# EAGLE design daisy-remote (EAGLE 7.6.0)
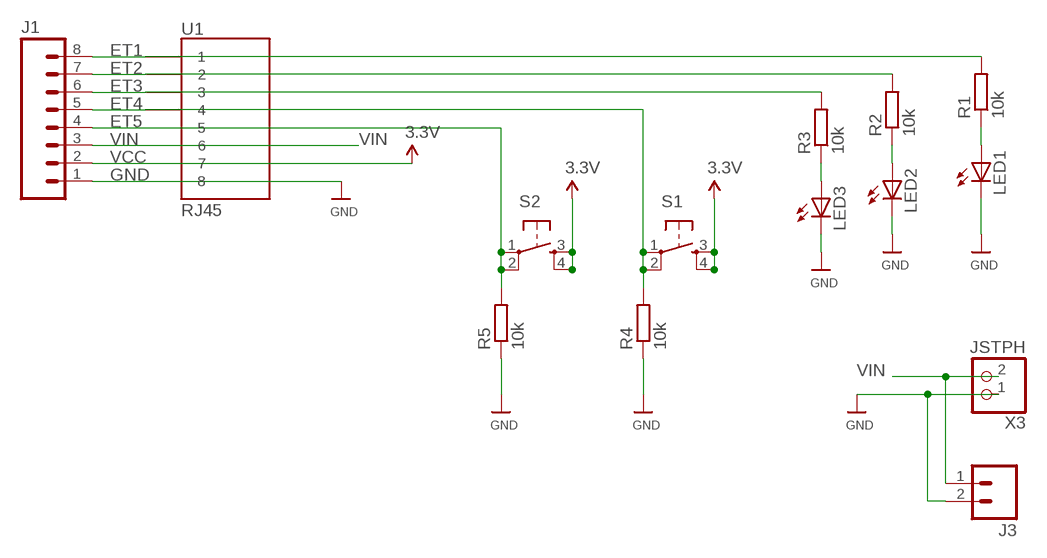
[diagram p0: schematic, sheet 1]

## Parts
J1  M08  [1X08_ROUND]
J3  M02PTH  [1X02]
LED1  LED5MM  [LED5MM]
LED2  LED5MM  [LED5MM]
LED3  LED5MM  [LED5MM]
R1  10k  R-EU_0204/7  [0204/7]
R2  10k  R-EU_0204/7  [0204/7]
R3  10k  R-EU_0204/7  [0204/7]
R4  10k  R-EU_0204/7  [0204/7]
R5  10k  R-EU_0204/7  [0204/7]
S1  TAC_SWITCHPTH  [TACTILE-PTH]
S2  TAC_SWITCHPTH  [TACTILE-PTH]
U1  RJ45  RJ45-8PTH  [RJ45-8]
X3  JSTPH  CON_JST_PH_2PIN  [JSTPH2]

## Nets
ET1: J1.8 R1.2 U1.1
ET2: J1.7 R2.2 U1.2
ET3: J1.6 R3.2 U1.3
ET4: J1.5 R4.2 S1.1 S1.2 U1.4
ET5: J1.4 R5.2 S2.1 S2.2 U1.5
GND [power]: J1.1 J3.2 LED1.K(C) LED2.K(C) LED3.K(C) R4.1 R5.1 U1.8 X3.1
N$2: LED1.A R1.1
N$3: LED2.A R2.1
N$5: LED3.A R3.1
VCC: J1.2 S1.3 S1.4 S2.3 S2.4 U1.7 ; supply symbol labelled 3.3V
VIN [power]: J1.3 J3.1 U1.6 X3.2

## Library data of the parts
J1 = SparkFun-Connectors:M08: Header 8 Standard 8-pin 0.1" header. Use with straight break away headers (SKU : PRT-00116), right angle break away headers (PRT-00553), swiss pins (PRT-00743), machine pins (PRT-00117), and female headers (PRT-00115).; PROD_ID: CONN-08437
J3 = SparkFun-Connectors:M02: Standard 2-pin 0.1" header. Use with - straight break away headers ( PRT-00116) - right angle break away headers (PRT-00553) - swiss pins (PRT-00743) - machine pins (PRT-00117) - female headers (PRT-00115) Molex polarized connector foot print use with: PRT-08233 with associated crimp pins and housings. 2.54_SCREWTERM for use with PRT-10571. 3.5mm Screw Terminal footprints for PRT-08084 5mm Screw Terminal footprints for use with PRT-08432
LED1-LED3 = led:LED: LED OSRAM: - CHIPLED LG R971, LG N971, LY N971, LG Q971, LY Q971, LO R971, LY R971 LH N974, LH R974 LS Q976, LO Q976, LY Q976 LO Q996 - Hyper CHIPLED LW Q18S LB Q993, LB Q99A, LB R99A - SideLED LS A670, LO A670, LY A670, LG A670, LP A670 LB A673, LV A673, LT A673, LW A673 LH A674 LY A675 LS A676, LA A676, LO A676, LY A676, LW A676 LS A679, LY A679, LG A679 - Hyper Micro SIDELED® LS Y876, LA Y876, LO Y876, LY Y876 LT Y87S - SmartLED LW L88C, LW L88S LB L89C, LB L89S, LG L890 LS L89K, LO L89K, LY L89K LS L896, LA L896, LO L896, LY L896 - TOPLED LS T670, LO T670, LY T670, LG T670, LP T670 LSG T670, LSP T670, LSY T670, LOP T670, LYG T670 LG T671, LOG T671, LSG T671 LB T673, LV T673, LT T673, LW T673 LH T674 LS T676, LA T676, LO T676, LY T676, LB T676, LH T676, LSB T676, LW T676 LB T67C, LV T67C, LT T67C, LS T67K, LO T67K, LY T67K, LW E67C LS E67B, LA E67B, LO E67B, LY E67B, LB E67C, LV E67C, LT E67C LW T67C LS T679, LY T679, LG T679 LS T770, LO T770, LY T770, LG T770, LP T770 LB T773, LV T773, LT T773, LW T773 LH T774 LS E675, LA E675, LY E675, LS T675 LS T776, LA T776, LO T776, LY T776, LB T776 LHGB T686 LT T68C, LB T68C - Hyper Mini TOPLED® LB M676 - Mini TOPLED Santana® LG M470 LS M47K, LO M47K, LY M47K Source: http://www.osram.convergy.de LUXEON: - LUMILED® LXK2-PW12-R00, LXK2-PW12-S00, LXK2-PW14-U00, LXK2-PW14-V00 LXK2-PM12-R00, LXK2-PM12-S00, LXK2-PM14-U00 LXK2-PE12-Q00, LXK2-PE12-R00, LXK2-PE12-S00, LXK2-PE14-T00, LXK2-PE14-U00 LXK2-PB12-K00, LXK2-PB12-L00, LXK2-PB12-M00, LXK2-PB14-N00, LXK2-PB14-P00, LXK2-PB14-Q00 LXK2-PR12-L00, LXK2-PR12-M00, LXK2-PR14-Q00, LXK2-PR14-R00 LXK2-PD12-Q00, LXK2-PD12-R00, LXK2-PD12-S00 LXK2-PH12-R00, LXK2-PH12-S00 LXK2-PL12-P00, LXK2-PL12-Q00, LXK2-PL12-R00 Source: www.luxeon.com KINGBRIGHT: KA-3528ASYC Source: www.kingbright.com
R1-R5 = resistor:R-EU_: RESISTOR, European symbol
S1 S2 = SparkFun-Retired:TAC_SWITCH: Momentary Switch Button commonly used for reset or general input. Spark Fun Electronics SKU : COM-00097 SMT- SWCH-08247
U1 = SparkFun:RJ45-8: RJ45 Jack Simple RJ45, 8-pin connection - connector for common Cat5, Cat5e, and Cat6 Ethernet cables. Footprint not yet proven in production. Connector sku is PRT-00643; Breakout PCB sku is BOB-00716.
X3 = microbuilder:CON_JST_PH_2PIN: JST 2-Pin Right-Angle Connector PH-Series - 4UConnector: 17311 SH-Series - 4UConnector: 07278

## Net classes
1 power: width 0.381 mm, clearance 0.254 mm

## Board
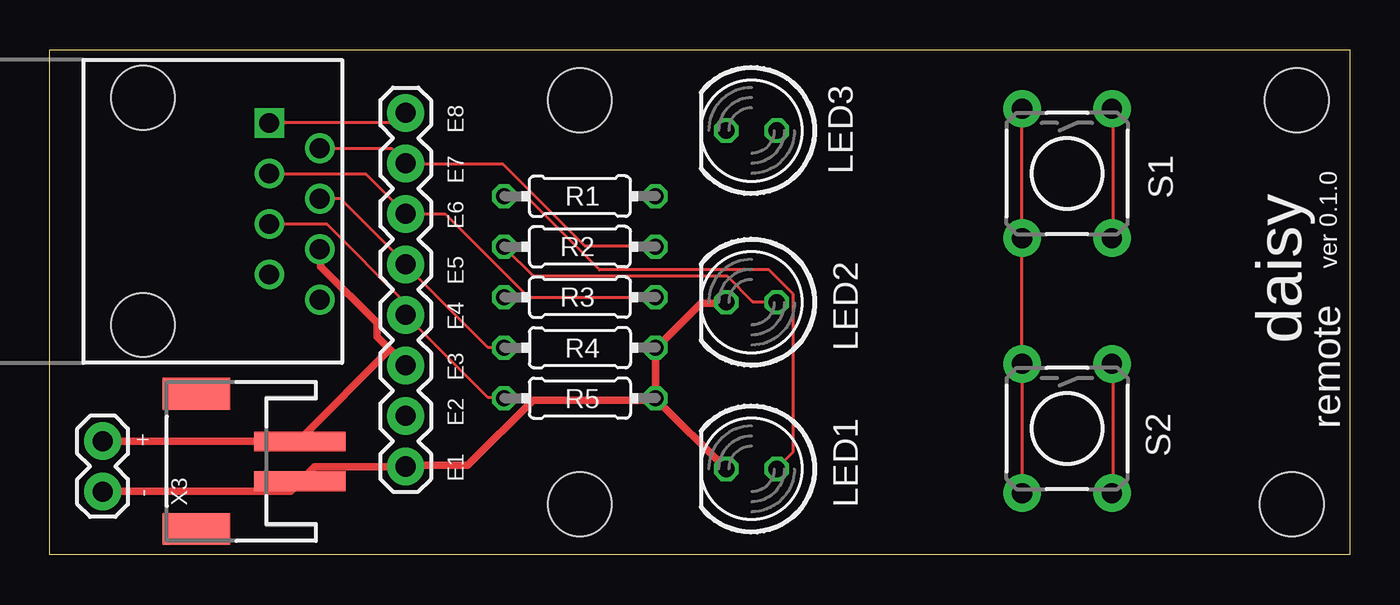
[diagram p1: board, top side]
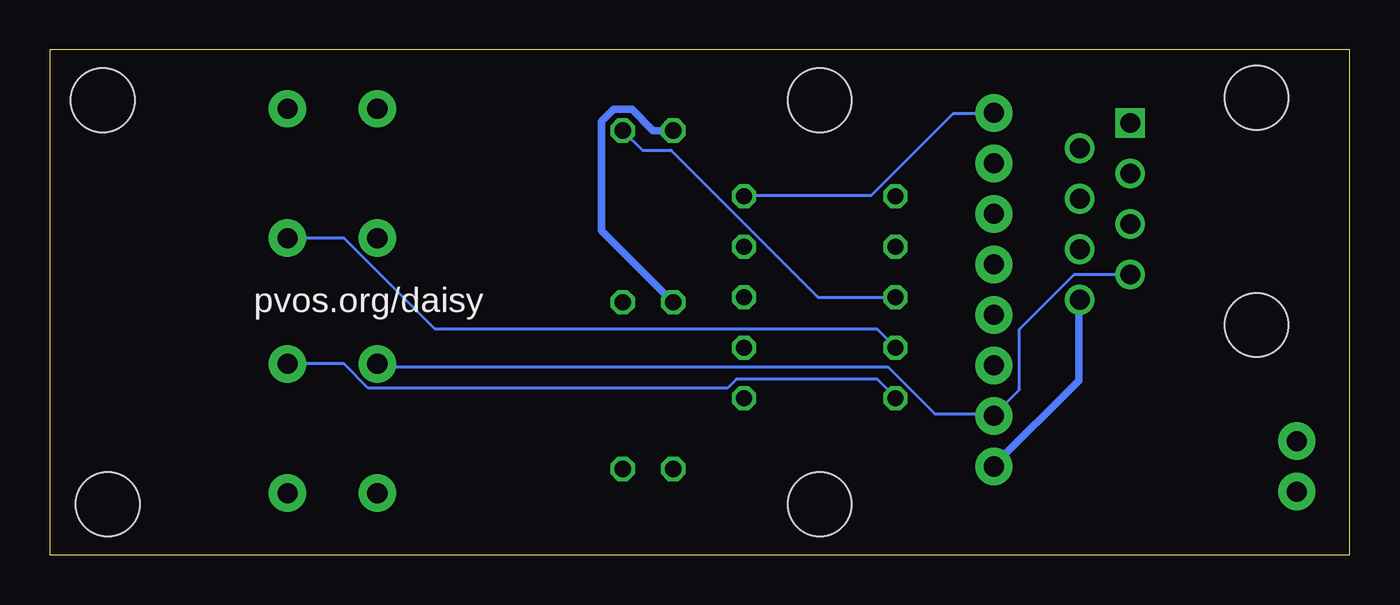
[diagram p2: board, bottom side, seen from below]

Size 65.41 x 25.4 mm. Coordinates in mm from the lower left corner, seen from the top.
Outline: 0,0 0,25.4 65.41,25.4 65.41,0 0,0
Copper layers (1*16): Top 0.0356mm / dielectric 1.5011mm / Bottom 0.0356mm
Design rules "LaenPCBOrder": minimum track width 6mil, minimum drill 13mil, track to track 6mil, track to pad 6mil, pad to pad 6mil, via to via 6mil, smd to smd 6mil, copper to edge 15mil, drill to drill 6mil, minimum pad ring 7mil, minimum via ring 7mil, stop-mask expansion 3mil, vias tented up to drill 0mil, thermal gap 10mil
Holes 3.2 mm at 26.67,22.86 26.67,2.54 62.74,22.86 62.48,2.54

### Footprints (pad centres in the part's own frame; a part is rotated, then mirrored left to right if it is on the bottom)
1X08_ROUND = drill 1.016 pad 1.88: 1 0,0; 2 2.54,0; 3 5.08,0; 4 7.62,0; 5 10.16,0; 6 12.7,0; 7 15.24,0; 8 17.78,0
1X02 = drill 1.016 pad 1.88: 1 0,0; 2 2.54,0
LED5MM = drill 0.813 octagon: A -1.27,0; K 1.27,0
0204/7 = drill 0.813 octagon: 1 -3.81,0; 2 3.81,0
TACTILE-PTH = drill 1.016 pad 1.88: 1 -3.251,2.261; 2 3.251,2.261; 3 -3.251,-2.261; 4 3.251,-2.261
RJ45-8 = drill 1 square: 1 -4.445,6.35 | drill 1: 2 -3.175,8.89; 3 -1.905,6.35; 4 -0.635,8.89; 5 0.635,6.35; 6 1.905,8.89; 7 3.175,6.35; 8 4.445,8.89 | hole 3.2: -5.715,0; 5.715,0
JSTPH2 = smd 1 x 4.6: 1 -1,-3.7; 2 1,-3.7 | smd 1.6 x 3.4: NC1 -3.4,1.5; NC2 3.4,1.5

### Placement (x,y rotation side)
J1  17.91,4.45 90 top
J3  2.67,5.71 270 top
LED1  35.31,4.32 180 top
LED2  35.31,12.7 180 top
LED3  35.31,21.34 180 top
R1  26.67,18.03 0 top
R2  26.67,15.49 0 top
R3  26.67,12.95 0 top
R4  26.67,10.41 180 top
R5  26.67,7.87 180 top
S1  51.18,19.18 270 top
S2  51.18,6.35 270 top
U1  4.7,17.27 270 top
X3  8.89,4.7 90 top

### Tracks (layer width: path | path; a pad name or v marks a point on that pad's centre or on a via)
ET1
  Top 0.152: U1.1 17.45,21.72 17.91,22.17 J1.8
  Bottom 0.152: R1.2 30.48,18.06 24.08,18.06 19.96,22.17 17.91,22.17 J1.8
ET2
  Top 0.152: R2.2 30.48,15.54 26.9,15.54 22.78,19.66 17.91,19.66 J1.7 17.91,19.74 17.22,20.42 13.64,20.42 U1.2
ET3
  Top 0.152: R3.2 24.08,12.95 19.89,17.14 J1.6 15.93,19.13 11.05,19.13 U1.3
ET4
  Top 0.152: S1.2 53.49,15.93 53.49,22.4 S1.1 | R4.2 22.86,10.44 22.02,10.44 17.91,14.55 J1.5 17.91,14.63 14.63,17.91 U1.4
  Bottom 0.152: S1.2 50.6,15.93 46.02,11.35 23.77,11.35 22.86,10.44 R4.2
ET5
  Top 0.152: S2.2 53.49,3.12 53.49,9.6 S2.1 | R5.2 22.86,7.92 22.02,7.92 17.91,12.04 J1.4 17.91,12.65 13.95,16.61 11.05,16.61 U1.5
  Bottom 0.152: S2.1 50.6,9.6 49.38,8.38 31.32,8.38 30.86,8.84 23.77,8.84 22.86,7.92 R5.2
GND
  Top 0.381: R5.1 R4.1 30.63,10.52 32.77,12.65 33.98,12.65 LED2.K | LED1.K 33.98,4.34 30.56,7.77 R5.1 | J3.2 2.67,3.2 12.12,3.2 12.57,3.66 X3.1 12.72,3.81 13.34,4.42 17.91,4.42 J1.1 18.06,4.5 21.03,4.5 24.31,7.77 30.33,7.77 R5.1
  Bottom 0.381: LED3.K 35.05,21.34 36.12,22.4 37.03,22.4 37.64,21.79 37.64,16.31 LED2.K | U1.8 13.64,12.8 13.64,8.76 17.91,4.5 J1.1
N$2
  Top 0.152: R1.1 22.86,17.98 24,17.98 27.66,14.33 36.2,14.33 37.41,13.11 37.41,5.18 36.58,4.34 LED1.A
N$3
  Top 0.152: LED2.A 36.58,12.72 35.36,12.72 34.06,14.02 24.31,14.02 22.86,15.47 R2.1
N$5
  Bottom 0.152: R3.1 26.75,12.95 34.14,20.34 35.59,20.34 LED3.A
VCC
  Top 0.152: S2.4 S2.3 S1.4 S1.3
  Bottom 0.152: U1.7 13.87,14.1 16.61,11.35 16.61,8.31 17.91,7.01 J1.2 17.91,7.09 20.88,7.09 23.24,9.45 48.77,9.45 S2.3
VIN
  Top 0.381: J1.3 17.11,10.32 | 17.11,10.32 16.46,10.97 16.46,11.66 13.64,14.48 13.64,15.32 U1.6 | J3.1 12.57,5.71 X3.2 12.65,5.87 17.11,10.32

### Text on the board
tPlace: ver 0.1.0 | daisy | remote
bPlace: pvos.org/daisy
tNames: E8 | E7 | E6 | E5 | E4 | E3 | E2 | + | E1 | -